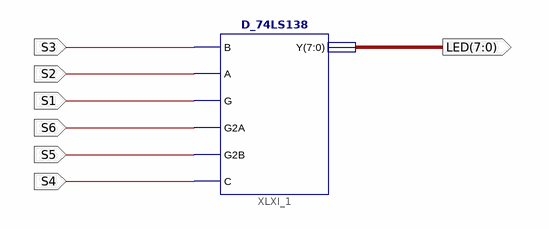
[diagram p0: schematic sheet 1]
// Xilinx ISE schematic D_74LS138_Test.sch (kintex7) as structural Verilog: 1 symbols, 7 ports
module D_74LS138_Test (
  input  S3,
  input  S2,
  input  S1,
  input  S6,
  input  S5,
  input  S4,
  output [7:0] LED
);

  D_74LS138 XLXI_1 (.B(S3), .A(S2), .G(S1), .G2A(S6), .G2B(S5), .C(S4), .Y(LED));
endmodule
